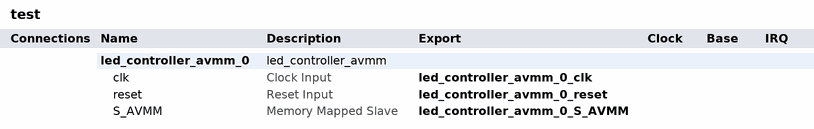
[diagram p0: system contents]
# Platform Designer (Qsys) system test
# Parameters at their usual value, and those the tool derives, are not listed.
package require qsys
create_system test

add_instance led_controller_avmm_0 led_controller_avmm 1.0.0

# exported interfaces
add_interface led_controller_avmm_0_clk clock sink
set_interface_property led_controller_avmm_0_clk EXPORT_OF led_controller_avmm_0.clk
add_interface led_controller_avmm_0_reset reset sink
set_interface_property led_controller_avmm_0_reset EXPORT_OF led_controller_avmm_0.reset
add_interface led_controller_avmm_0_S_AVMM avalon slave
set_interface_property led_controller_avmm_0_S_AVMM EXPORT_OF led_controller_avmm_0.S_AVMM

save_system test.qsys
